# Altium schematic sheet HV_Indicator.SchDoc
size A
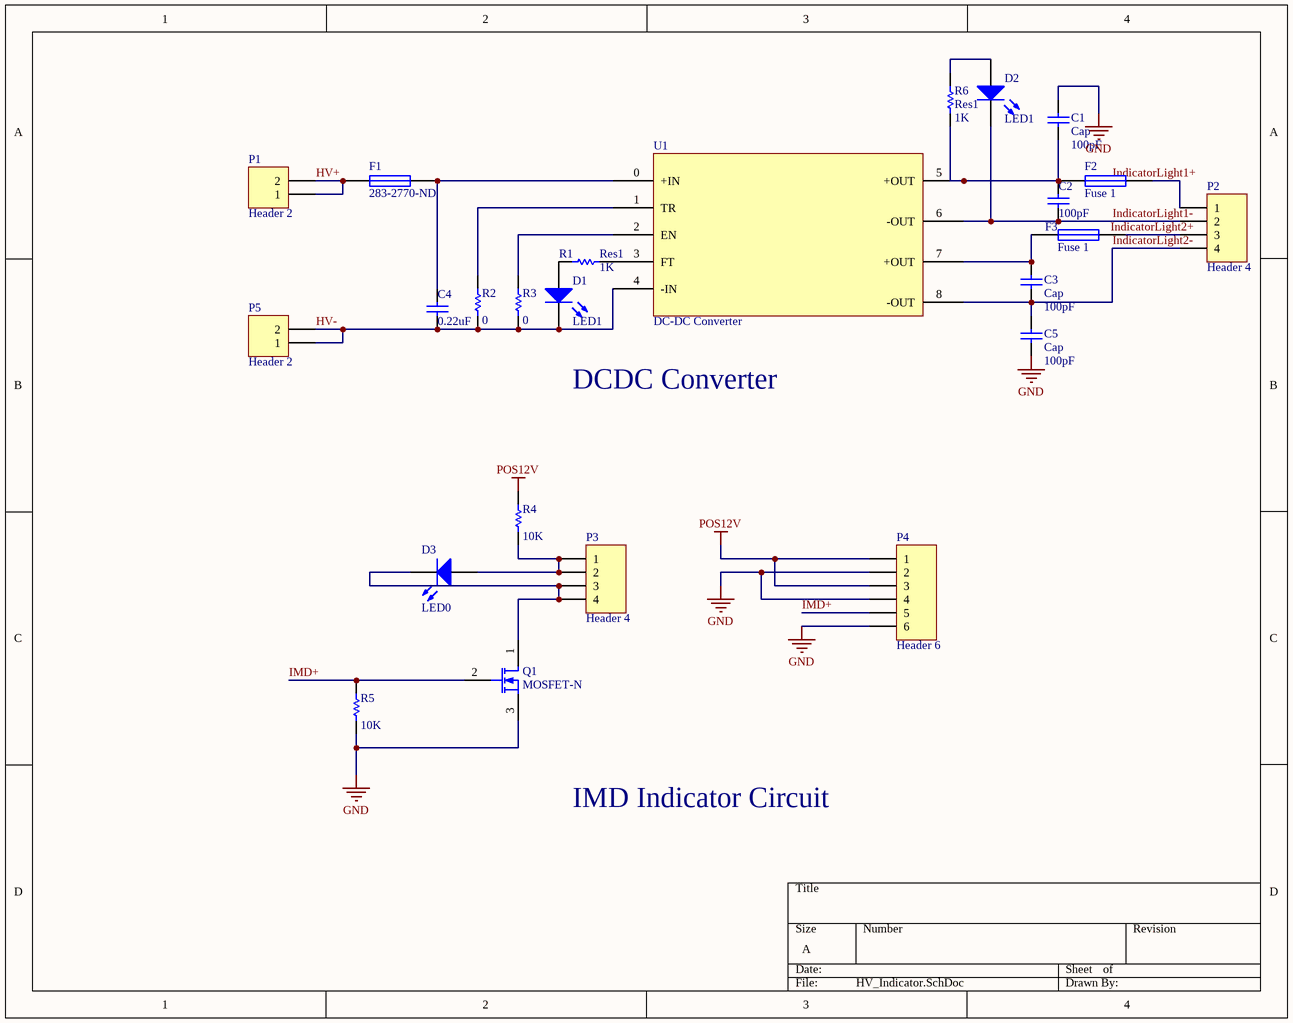
[diagram p0: HV_Indicator.SchDoc]

## Parts
C1  Cap  value 100pF  [1206]
C2  value 100pF  [1206]  (hidden comment: Cap)
C3  Cap  value 100pF  [1206]
C4  value 0.22uF  [RAD-0.3]  (hidden comment: Cap)
C5  Cap  value 100pF  [1206]
D1  LED1  [1206 DIODE]
D2  LED1  [1206 DIODE]
D3  LED0  [1206 LED]
F1  283-2770-ND  [RAD-0.2]
F2  Fuse 1  [FuseHolder]
F3  Fuse 1  [FuseHolder]
P1  Header 2  [2POS TERM BLOCK]
P2  Header 4  [4POS TERM BLOCK]
P3  Header 4  [4POS TERM BLOCK]
P4  Header 6  [6POS TERM BLOCK]
P5  Header 2  [2POS TERM BLOCK]
Q1  MOSFET-N  [SOT-23-3]
R1  Res1  value 1K  [1206]
R2  value 0  [1206]  (hidden comment: Res1)
R3  value 0  [1206]  (hidden comment: Res1)
R4  value 10K  [1206]  (hidden comment: Res1)
R5  value 10K  [1206]  (hidden comment: Res1)
R6  Res1  value 1K  [1206]
U1  DC-DC Converter  [DCM290y138x600A40]

## Nets
GND: C1.2 C5.1 P4.2 P4.4 P4.6 Q1.3(S) R5.1
POS12V: P4.1 P4.3 R4.2
HV+: F1.1 P1.1 P1.2
HV-: C4.1 D1.2(K) P5.1 P5.2 R2.1 R3.1 U1.4(-IN)
IMD+: P4.5 Q1.2(G) R5.2
IndicatorLight1-: C2.1 D2.2(K) P2.2 U1.6(-OUT)
IndicatorLight2-: C3.1 C5.2 P2.4 U1.8(-OUT)
NetC1_1: C1.1 C2.2 F2.1 R6.1 U1.5(+OUT)
NetC3_2: C3.2 F3.1 U1.7(+OUT)
NetC4_2: C4.2 F1.2 U1.0(+IN)
NetD1_1: D1.1(A) R1.2
NetD2_1: D2.1(A) R6.2
NetD3_1: D3.1(A) P3.1 P3.2 R4.1
NetD3_2: D3.2(K) P3.3 P3.4 Q1.1(D)
NetF2_2: F2.2 P2.1
NetF3_2: F3.2 P2.3
NetR1_1: R1.1 U1.3(FT)
NetR2_2: R2.2 U1.1(TR)
NetR3_2: R3.2 U1.2(EN)

## Notes on the sheet
- DCDC Converter
- IMD Indicator Circuit
- Labels drawn without touching a wire or pin: IndicatorLight1+, IndicatorLight2+

## Library data of the parts
C1-C5 = Cap: Capacitor; Published: 8-Jun-2000; LatestRevisionDate: 17-Jul-2002; LatestRevisionNote: Re-released for DXP Platform.; PackageReference: RAD-0.3; Publisher: Altium Limited; PackageDescription: Radial Cap, Thru-Hole; 2 Leads; 0.3 in Pin Spacing
D1 D2 = LED1: Typical RED GaAs LED; Published: 8-Jun-2000; LatestRevisionDate: 08-Jul-2005; LatestRevisionNote: Mech Layer 1 removed.; PackageReference: LED-1; Publisher: Altium Limited; PackageDescription: LED; 2 Leads
D3 = LED0: Typical INFRARED GaAs LED; Published: 8-Jun-2000; LatestRevisionDate: 08-Jul-2005; LatestRevisionNote: Mech Layer 1 removed.; PackageReference: LED-0; Publisher: Altium Limited; PackageDescription: LED; 2 Leads
F1-F3 = Fuse 1: Fuse; Published: 8-Jun-2000; LatestRevisionDate: 17-Jul-2002; LatestRevisionNote: Re-released for DXP Platform.; PackageReference: PIN-W2/E2.8; Publisher: Altium Limited; PackageDescription: Thru-Hole; 2 Leads
P1 P5 = Header 2: Header, 2-Pin; LatestRevisionDate: 17-Jul-2002; LatestRevisionNote: Re-released for DXP Platform.; Publisher: Altium Limited
P2 P3 = Header 4: Header, 4-Pin; LatestRevisionDate: 17-Jul-2002; LatestRevisionNote: Re-released for DXP Platform.; Publisher: Altium Limited
P4 = Header 6: Header, 6-Pin; LatestRevisionDate: 17-Jul-2002; LatestRevisionNote: Re-released for DXP Platform.; Publisher: Altium Limited
Q1 = MOSFET-N: N-Channel MOSFET; pin to pad: 1>D 2>G 3>S; Published: 8-Jun-2000; LatestRevisionDate: 17-Jul-2002; LatestRevisionNote: Re-released for DXP Platform.; PackageVersion: 1995/1996; PackageReference: E3; Publisher: Altium Limited; PackageDescription: TO, Flat Index; 3 In-Line, Axial Leads; Body Dia. 4.6mm; Lead Dia. 0.5 mm (max)
R1-R6 = Res1: Resistor; Published: 8-Jun-2000; LatestRevisionDate: 17-Jul-2002; LatestRevisionNote: Re-released for DXP Platform.; PackageReference: AXIAL-0.3; Publisher: Altium Limited; PackageDescription: Axial Device, Thru-Hole; 2 Leads; 0.3 in Pin Spacing